# Altium schematic sheet 驱动.SchDoc: 驱动
size A4; Organization: Altium Limited; Address1: L3, 12a Rodborough Rd; Address2: Frenchs Forest; Address3: NSW; Address4: Australia 2086; DocumentNumber: 3; Revision: V1.0; SheetNumber: 3; SheetTotal: 6; Designer: 樊浩柏
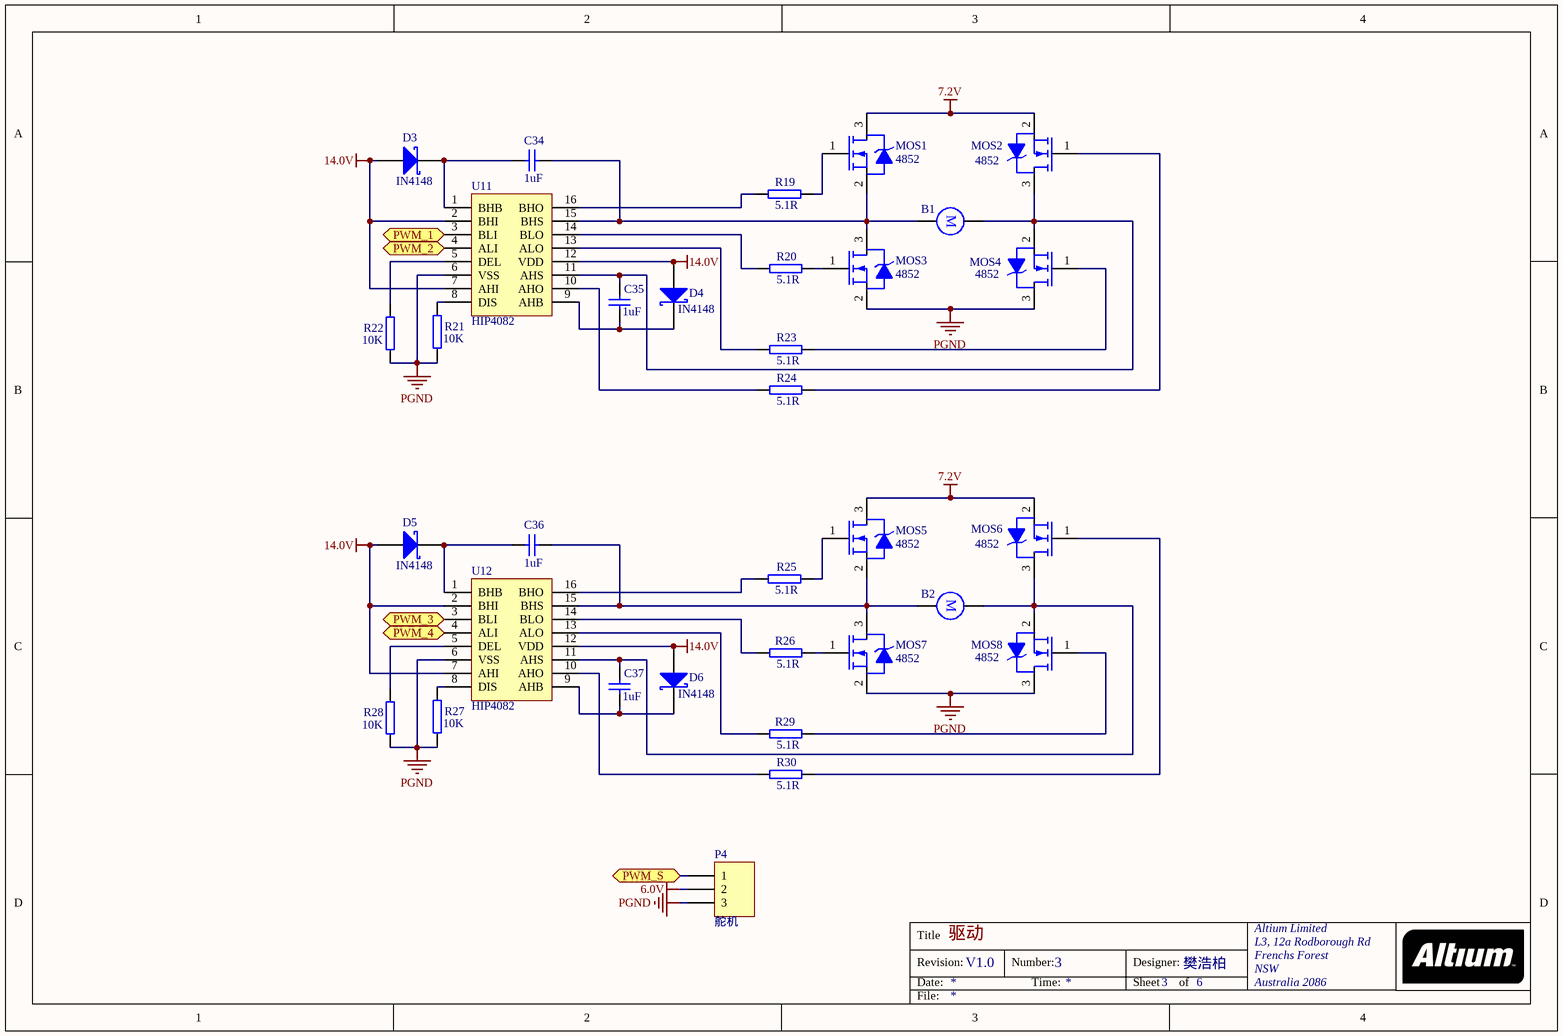
[diagram p0: 驱动.SchDoc]

## Parts
B1  Motor  [Header-5.0-SMD]  (value not drawn)
B2  Motor  [Header-5.0-SMD]  (value not drawn)
C34  1uF  [CAP-0603]
C35  1uF  [CAP-0603]
C36  1uF  [CAP-0603]
C37  1uF  [CAP-0603]
D3  IN4148  [Diode-SMD-1206]
D4  IN4148  [Diode-SMD-1206]
D5  IN4148  [Diode-SMD-1206]
D6  IN4148  [Diode-SMD-1206]
MOS1  4852  [DFN-5_5X6MM]
MOS2  4852  [DFN-5_5X6MM]
MOS3  4852  [DFN-5_5X6MM]
MOS4  4852  [DFN-5_5X6MM]
MOS5  4852  [DFN-5_5X6MM]
MOS6  4852  [DFN-5_5X6MM]
MOS7  4852  [DFN-5_5X6MM]
MOS8  4852  [DFN-5_5X6MM]
P4  舵机  [Pin-Header-2.54-Single-3]
R19  5.1R  [RES-0603]
R20  5.1R  [RES-0603]
R21  10K  [RES-0603]
R22  10K  [RES-0603]
R23  5.1R  [RES-0603]
R24  5.1R  [RES-0603]
R25  5.1R  [RES-0603]
R26  5.1R  [RES-0603]
R27  10K  [RES-0603]
R28  10K  [RES-0603]
R29  5.1R  [RES-0603]
R30  5.1R  [RES-0603]
U11  HIP4082  [SOP-16]
U12  HIP4082  [SOP-16]

## Ports
PWM_1, PWM_2, PWM_3, PWM_4, PWM_S

## Nets
6.0V: P4.2
7.2V: MOS1.3(D) MOS2.2(S) MOS5.3(D) MOS6.2(S)
14.0V: D3.A D4.A D5.A D6.A U11.2(BHI) U11.7(AHI) U11.12(VDD) U12.2(BHI) U12.7(AHI) U12.12(VDD)
PGND: MOS3.2(S) MOS4.3(D) MOS7.2(S) MOS8.3(D) P4.3 R21.1 R22.1 R27.1 R28.1 U11.6(VSS) U12.6(VSS)
PWM_1: U11.3(BLI) ; port PWM_1
PWM_2: U11.4(ALI) ; port PWM_2
PWM_3: U12.3(BLI) ; port PWM_3
PWM_4: U12.4(ALI) ; port PWM_4
PWM_S: P4.1 ; port PWM_S
NetB1_1: B1.1 C35.1 MOS2.3(D) MOS4.2(S) U11.11(AHS)
NetB1_2: B1.2 C34.1 MOS1.2(S) MOS3.3(D) U11.15(BHS)
NetB2_1: B2.1 C37.1 MOS6.3(D) MOS8.2(S) U12.11(AHS)
NetB2_2: B2.2 C36.1 MOS5.2(S) MOS7.3(D) U12.15(BHS)
NetC34_2: C34.2 D3.K U11.1(BHB)
NetC35_2: C35.2 D4.K U11.9(AHB)
NetC36_2: C36.2 D5.K U12.1(BHB)
NetC37_2: C37.2 D6.K U12.9(AHB)
NetMOS1_1: MOS1.1(G) R19.1
NetMOS2_1: MOS2.1(G) R24.1
NetMOS3_1: MOS3.1(G) R20.1
NetMOS4_1: MOS4.1(G) R23.1
NetMOS5_1: MOS5.1(G) R25.1
NetMOS6_1: MOS6.1(G) R30.1
NetMOS7_1: MOS7.1(G) R26.1
NetMOS8_1: MOS8.1(G) R29.1
NetR19_2: R19.2 U11.16(BHO)
NetR20_2: R20.2 U11.14(BLO)
NetR21_2: R21.2 U11.8(DIS)
NetR22_2: R22.2 U11.5(DEL)
NetR23_2: R23.2 U11.13(ALO)
NetR24_2: R24.2 U11.10(AHO)
NetR25_2: R25.2 U12.16(BHO)
NetR26_2: R26.2 U12.14(BLO)
NetR27_2: R27.2 U12.8(DIS)
NetR28_2: R28.2 U12.5(DEL)
NetR29_2: R29.2 U12.13(ALO)
NetR30_2: R30.2 U12.10(AHO)

## Notes on the sheet
- Title
- Revision:
- Date:
- Number:
- Time:
- Designer:
- Sheet
- of
- File:
- (in symbol Motor) M

## Library data of the parts
C34-C37 = Cap
D3-D6 = Diode-Schottky
MOS1-MOS8 = N-MOS: pin to pad: 1>G 2>S 3>D
P4 = CON-3X1
R19-R30 = Res
B1 B2 = Motor: Published: 24-Mar-1999; LatestRevisionDate: 17-Jul-2002; LatestRevisionNote: Re-released for DXP Platform.; PackageReference: RB5-10.5; Publisher: Altium Limited; PackageDescription: Capacitor (Radial); 2 Leads